# EAGLE design Tiles_Proto2_RevD (EAGLE 8.4.1)
CNAME: Tiles; CREVISION: D; DESIGNER: Simone Mora
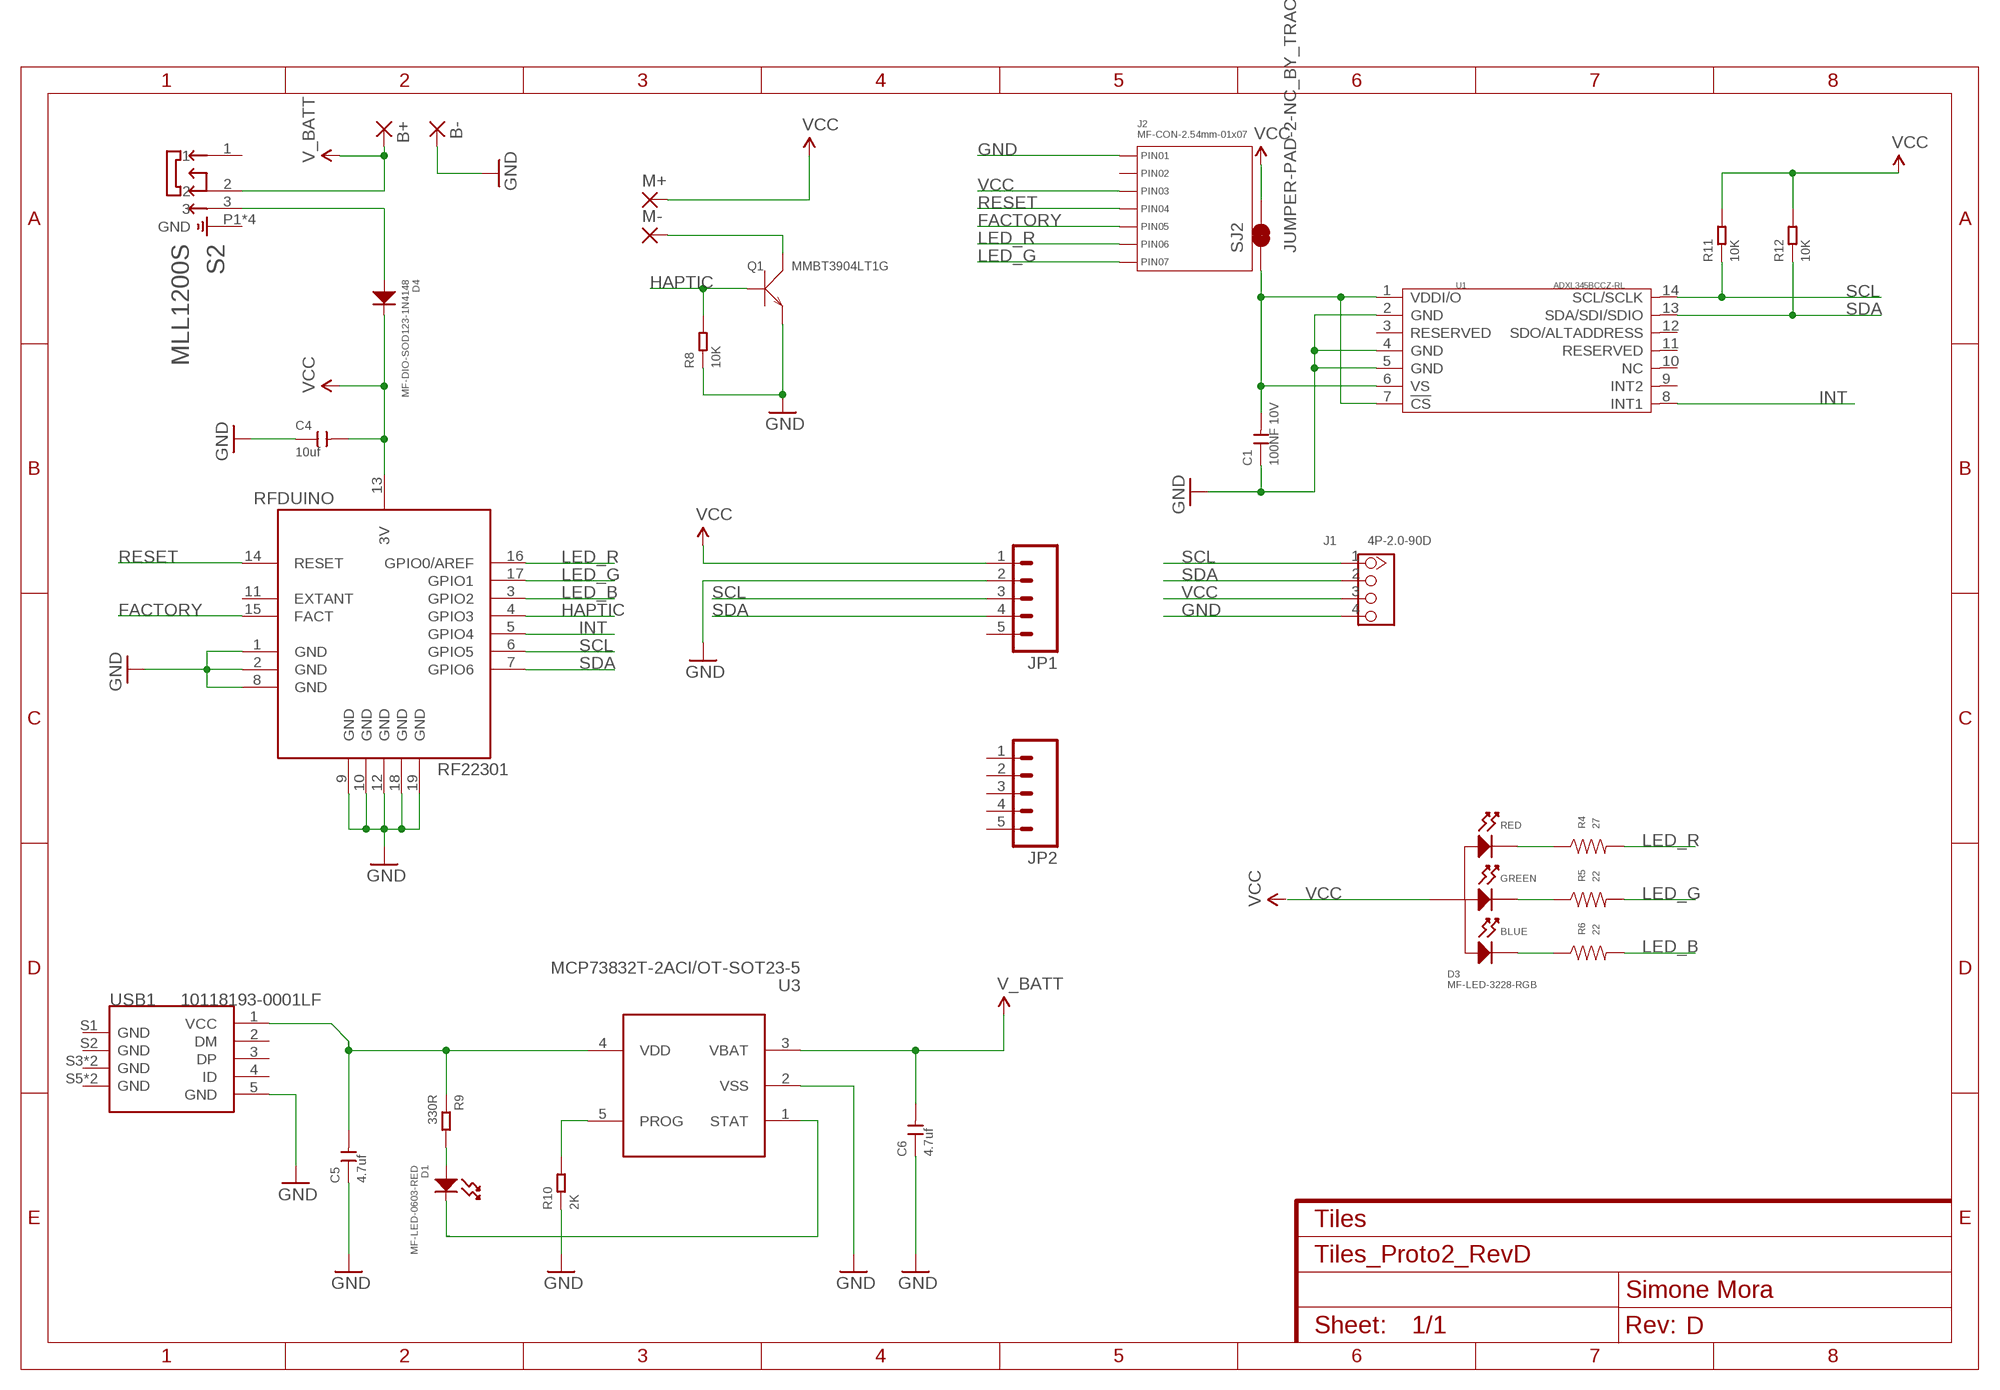
[diagram p0: schematic, sheet 1]

## Parts
B+  SMD2  [SMD1,27-2,54]
B-  SMD2  [SMD1,27-2,54]
C1  100NF 10V  CERAMIC 100NF-10V-10%-X5R(0402)  [C0402]
C4  10uf  CERAMIC-10UF-6.3V-20%-X5R(0402)  [C0402]
C5  4.7uf  CERAMIC-4.7UF-6.3V-20%-X5R(0402)  [C0402]
C6  4.7uf  CERAMIC-4.7UF-6.3V-20%-X5R(0402)  [C0402]
D1  MF-LED-0603-RED  LED_SINGLE-0603-RED  [LED0603]
D3  MF-LED-3228-RGB  LED_RGB_CA_PLCC4  [PLCC4]
D4  MF-DIO-SOD123-1N4148  DIODES_1N4148_SOD-123  [SOD-123]
J1  4P-2.0-90D  GROVE-CONNECTOR-DIP-90D(4P-2.0)  [HW4-2.0-90D]
J2  MF-CON-2.54mm-01x07  CON_01X07_PTH_2.54MM  [PTH_2.54MM_01X07]
JP1  M05PTH  [1X05]
JP2  M05PTH  [1X05]
M+  SMD2  [SMD1,27-2,54]
M-  SMD2  [SMD1,27-2,54]
Q1  MMBT3904LT1G  SMD-TRANSISTORS-NPN-40V-200MA-MMBT3904LT1G(SOT-23)  [SOT-23]
R4  27  RESISTOR_0603  [R0603]
R5  22  RESISTOR_0603  [R0603]
R6  22  RESISTOR_0603  [R0603]
R8  10K  SMD-RES-10K-1%-1/10W(0603)  [R0603]
R9  330R  SMD-RES-330R-1%-1/10W(0603)  [R0603]
R10  2K  SMD-RES-2K-5%-1/10W(0603)  [R0603]
R11  10K  SMD-RES-10K-1%-1/10W(0603)  [R0603]
R12  10K  SMD-RES-10K-1%-1/10W(0603)  [R0603]
RFDUINO  RF22301  [RFD22301]
S2  MLL1200S  [SW_MLL1200S]
SJ2  JUMPER-PAD-2-NC_BY_TRACE  [PAD-JUMPER-2-NC_BY_TRACE_YES_SILK]
U1  ADXL345BCCZ-RL  MOTION/POSITION-ADXL345BCCZ-RL(14P-5.0X3.0MM)  [LGA14-0.8-5.0X3.0MM]
U3  MCP73832T-2ACI/OT-SOT23-5  PMIC-MCP73832T-2ACI/OT(SOT23-5)  [SOT-23-5]
USB1  10118193-0001LF  MICRO-USB-SMD-B-(10118193-0001LF)  [MICRO-USB5+6P-SMD-0.65-B]

## Nets
FACTORY: J2.P$5(PIN5) RFDUINO.15(FACT)
GND: B-.1(P) C1.1 C4.1 C5.1 C6.1 J1.4 J2.P$1(PIN1) JP1.2 Q1.2(E) R8.1 R10.1 RFDUINO.1(GND) RFDUINO.2(GND) RFDUINO.8(GND) RFDUINO.9(GND) RFDUINO.10(GND) RFDUINO.12(GND) RFDUINO.18(GND) RFDUINO.19(GND) U1.2(GND) U1.4(GND) U1.5(GND) U3.2(VSS) USB1.5(GND)
HAPTIC: Q1.1(B) R8.2 RFDUINO.4(GPIO3)
INT: RFDUINO.5(GPIO4) U1.8(INT1)
LED_B: R6.P$2 RFDUINO.3(GPIO2)
LED_G: J2.P$7(PIN7) R5.P$2 RFDUINO.17(GPIO1)
LED_R: J2.P$6(PIN6) R4.P$2 RFDUINO.16(GPIO0/AREF)
N$5: D3.P$2(CATHODE_RED) R4.P$1
N$6: D3.P$3(CATHODE_GREEN) R5.P$1
N$7: M-.1(P) Q1.3(C)
N$8: C5.2 R9.1 U3.4(VDD) USB1.1(VCC)
N$9: D4.ANODE S2.3
N$10: D1.ANODE R9.2
N$11: D1.CATHODE U3.1(STAT)
N$12: R10.2 U3.5(PROG)
N$13: D3.P$4(CATHODE_BLUE) R6.P$1
RESET: J2.P$4(PIN4) RFDUINO.14(RESET)
SCL: J1.1 JP1.3 R11.1 RFDUINO.6(GPIO5) U1.14(SCL/SCLK)
SDA: J1.2 JP1.4 R12.1 RFDUINO.7(GPIO6) U1.13(SDA/SDI/SDIO)
V_BATT: B+.1(P) C6.2 S2.2 U3.3(VBAT)
VCC: C4.2 D3.P$1(ANODE) D4.CATHODE J1.3 J2.P$3(PIN3) JP1.1 M+.1(P) R11.2 R12.2 RFDUINO.13(3V) SJ2.2
VDDI/O: C1.2 SJ2.1 U1.1(VDDI/O) U1.6(VS) U1.7(!CS)
Unconnected: J2.P$2(PIN2) JP1.5 JP2.1 JP2.2 JP2.3 JP2.4 JP2.5 RFDUINO.11(EXTANT) S2.1 U1.3(RESERVED) U1.9(INT2) U1.10(NC) U1.11(RESERVED) U1.12(SDO/ALTADDRESS) USB1.2(DM) USB1.3(DP) USB1.4(ID) USB1.S1(GND) USB1.S2(GND) USB1.S3(GND) USB1.S4(GND) USB1.S5(GND) USB1.S6(GND)

## Power pins joined to a net without a drawn wire
GND: S2.P1(GND) S2.P2(GND) S2.P3(GND) S2.P4(GND)

## Library data of the parts
B+ B- M+ M- = wirepad:SMD2: SMD PAD
C1 = Seeed-OPL-Capacitor:CERAMIC 100NF-10V-10%-X5R(0402): 302010037; MPN: CC0402KRX5R6BB104
C4 = Seeed-OPL-Capacitor:CERAMIC-10UF-6.3V-20%-X5R(0402): 302010053; MPN: CC0402MRX5R5BB106
C5 C6 = Seeed-OPL-Capacitor:CERAMIC-4.7UF-6.3V-20%-X5R(0402): 302010019; MPN: CC0402MRX5R5BB475
D1 = MF_LEDs:LED_SINGLE: Library: MF_LEDs Description: Device for Single LED Packages. Manufacture part number (MFG#) can be added via Attributes.; HOUSEPART: YES; MPN: MF-LED-0603-RED; POPULATE: 1; URL: https://factory.macrofab.com/part/MF-LED-0603-RED
D3 = MF_LEDs:LED_RGB_CA: Library: MF_LEDs Description: Device for RGB LED Packages with Common Anodes. Manufacture part number (MFG#) can be added via Attributes.; HOUSEPART: YES; MPN: MF-LED-3228-RGB; POPULATE: 1; URL: https://factory.macrofab.com/part/MF-LED-3228-RGB
D4 = MF_Discrete_Semiconductor:DIODES: Library: MF_Discrete_Semiconductor Description: Device for Single Packaged Diodes.; HOUSEPART: YES; MPN: MF-DIO-SOD123-1N4148; POPULATE: 1; URL: https://factory.macrofab.com/part/MF-DIO-SOD123-1N4148
J1 = Seeed-OPL-Connector:GROVE-CONNECTOR-DIP-90D(4P-2.0): 320110034
J2 = MF_Connectors:CON_01X07: Library: MF_Connectors Description: Header Connector with 7 Positions and 01 Rows. Use the LABEL Attribute to label the pin on the schematic and PCB. You can remove the attributes on the PCB by using the SMASH function on the part and then deleting the text.; HOUSEPART: YES; MPN: MF-CON-2.54mm-01x07; POPULATE: 1; URL: https://factory.macrofab.com/part/MF-CON-2.54mm-01x07
JP1 JP2 = SparkFun-Connectors:M05: Header 5 Standard 5-pin 0.1" header. Use with straight break away headers (SKU : PRT-00116), right angle break away headers (PRT-00553), swiss pins (PRT-00743), machine pins (PRT-00117), and female headers (PRT-00115). Molex polarized connector foot print use with SKU : PRT-08230 with associated crimp pins and housings.
Q1 = Seeed-OPL-Transistor:SMD-TRANSISTORS-NPN-40V-200MA-MMBT3904LT1G(SOT-23): 305010013; MPN: MMBT3904LT1G
R4 = MF_Passives:RESISTOR: Library: MF_Passives Description: Device for Resistors. Manufacture part number (MPN), Voltage, Tolerance, and Wattage Rating can be added via Attributes. Check https://factory.macrofab.com/parts for the house parts list.; HOUSEPART: MF-RES-0603-27; POPULATE: 1
R5 R6 = MF_Passives:RESISTOR: Library: MF_Passives Description: Device for Resistors. Manufacture part number (MPN), Voltage, Tolerance, and Wattage Rating can be added via Attributes. Check https://factory.macrofab.com/parts for the house parts list.; HOUSEPART: MF-RES-0603-22; POPULATE: 1
R8 R11 R12 = Seeed-OPL-Resistor:SMD-RES-10K-1%-1/10W(0603): 301010299; MPN: RC0603FR-0710KL
R9 = Seeed-OPL-Resistor:SMD-RES-330R-1%-1/10W(0603): 301010300; MPN: RC0603FR-07330RL
R10 = Seeed-OPL-Resistor:SMD-RES-2K-5%-1/10W(0603): 301010113; MPN: RC0603JR-072KL
RFDUINO = GeekAmmo:RF22301: RFD22301 RFDuino Bluetooth 4.0 Low Energy BLE RF Module With Built-In ARM Cortex M0 Microconroller Hi performance, professional grade Bluetooth 4.0 Low Energy radio transceiver with built-in ARM Cortex M0 microcontroller that can be programmed using the simple-to-use Arduino IDE using RFduino extensions. Built-in user application microcontroller with ADC, I2C, SPI, UART and GPIO. http://www.rfduino.com/
S2 = MLL1200S:MLL1200S: Switch Slide SPDT Side Slide 0.3A 4VDC Gull Wing SMD Box; AVAILABILITY: Good; DESCRIPTION: Switch Slide SPDT Side Slide 0.3A 4VDC Gull Wing SMD Box; MF: TE Connectivity; MP: MLL1200S; PACKAGE: None; PRICE: 1.59 USD
SJ2 = SparkFun-Passives:JUMPER-PAD-2-NC_BY_TRACE
U1 = Seeed-OPL-sensor:MOTION/POSITION-ADXL345BCCZ-RL(14P-5.0X3.0MM): 314080008; MPN: ADXL345BCCZ-RL
U3 = Seeed-OPL-ic:PMIC-MCP73832T-2ACI/OT(SOT23-5): 310030238; MPN: MCP73832T-2ACI/OT
USB1 = Seeed-OPL-Connector:MICRO-USB-SMD-B-(10118193-0001LF): 320010003; MPN: 10118193-0001LF

## Board
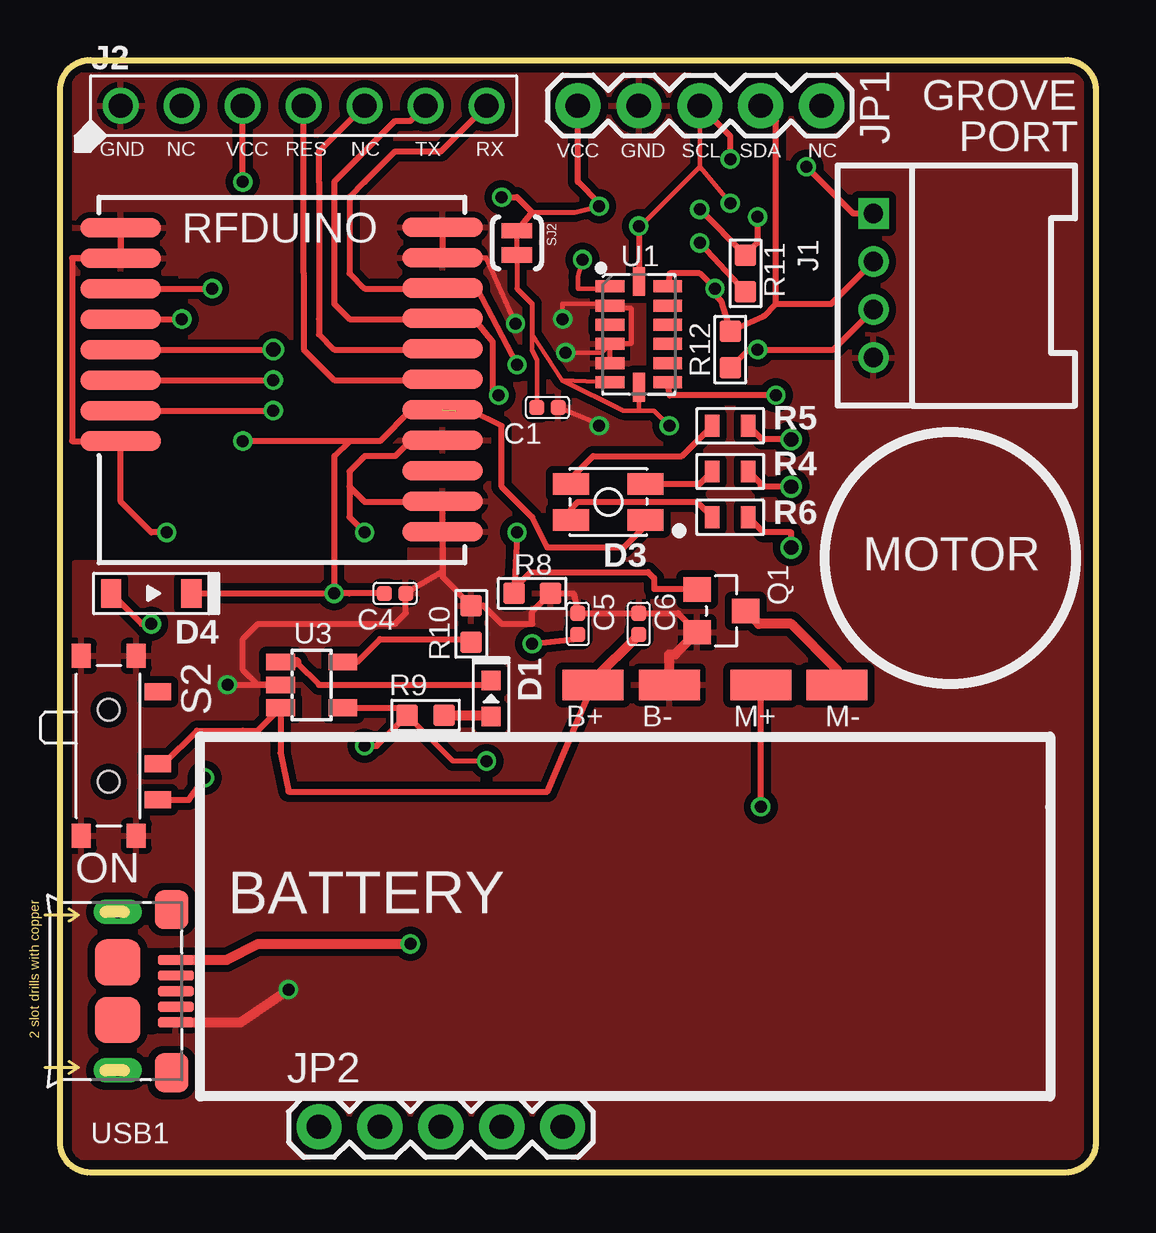
[diagram p1: board, top side]
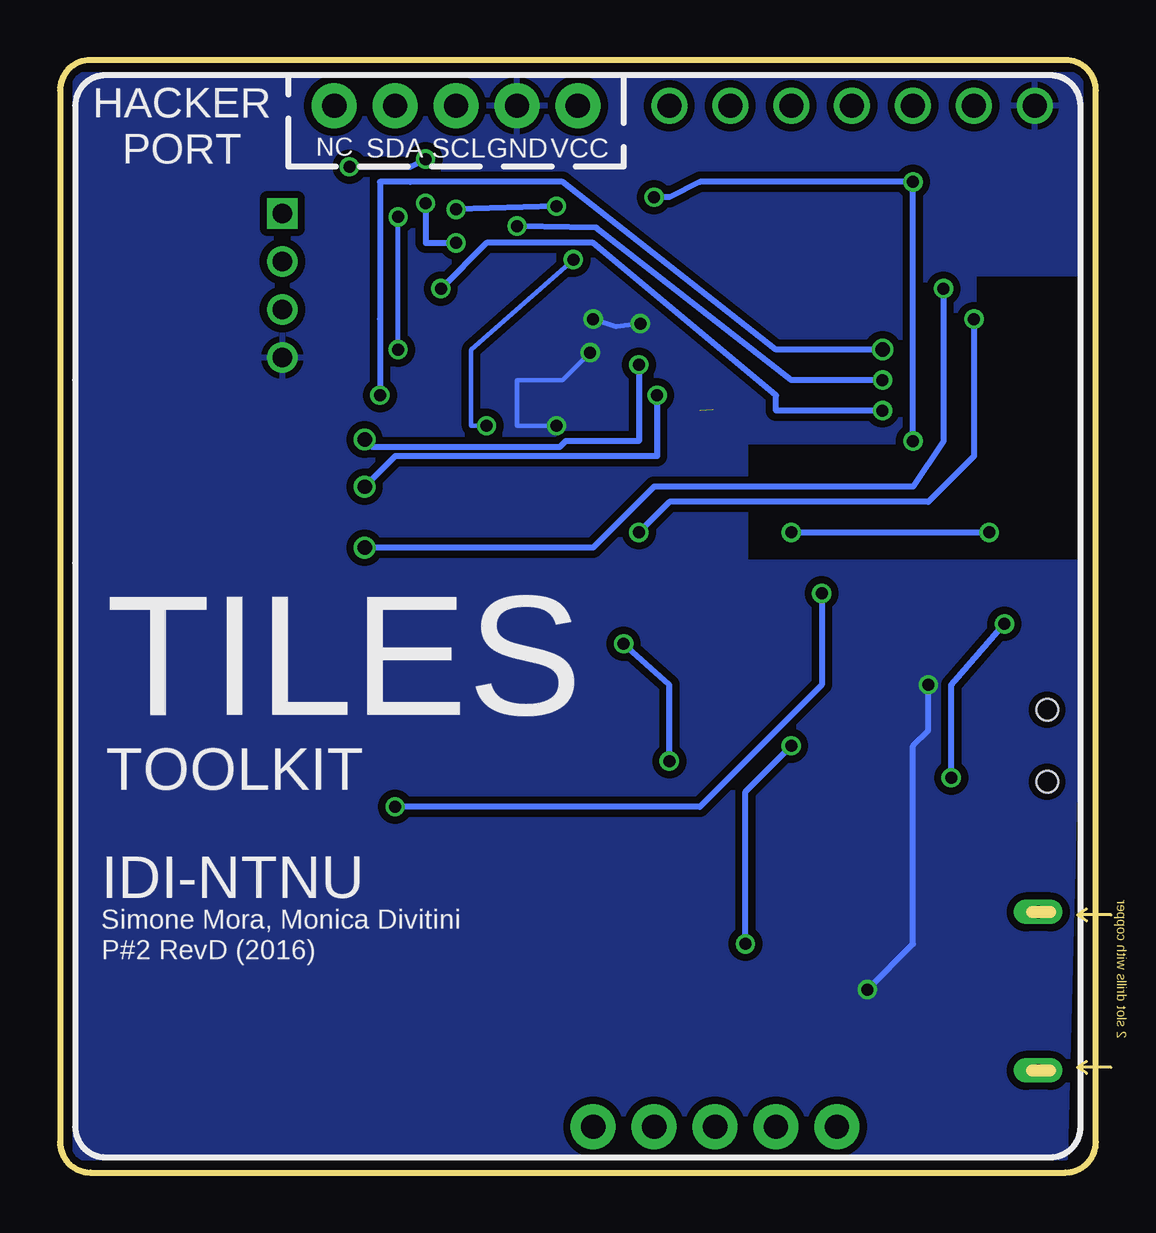
[diagram p2: board, bottom side, seen from below]

Size 43.18 x 46.36 mm. Coordinates in mm from the lower left corner, seen from the top.
Outline: 41.91,0 1.27,0 arc-90 0,1.27 0,45.08 arc-90 1.27,46.36 41.91,46.36 arc-90 43.18,45.08 43.18,1.27 arc-90 41.91,0
Copper layers (1*16): Top 0.035mm / dielectric 1.5mm / Bottom 0.035mm
Design rules "MF_Standard_2_Layer": minimum track width 5mil, minimum drill 12mil, track to track 5mil, track to pad 5mil, pad to pad 5mil, via to via 5mil, smd to smd 0mil, copper to edge 10mil, drill to drill 10mil, minimum pad ring 6mil, minimum via ring 6mil, stop-mask expansion 2mil, vias tented up to drill 25mil, thermal gap 10mil

### Footprints (pad centres in the part's own frame; a part is rotated, then mirrored left to right if it is on the bottom)
SMD1,27-2,54 = smd 1.27 x 2.54: 1 0,0
C0402 = smd 0.635 x 0.635: 1 0,0.445; 2 0,-0.445
LED0603 = smd 0.8 x 0.8: ANODE 0.75,0; CATHODE -0.75,0
PLCC4 = smd 1.5 x 0.9: P$1 -1.55,0.75; P$2 -1.55,-0.75; P$3 1.55,-0.75; P$4 1.55,0.75
SOD-123 = smd 0.85 x 1.2: ANODE 1.675,0; CATHODE -1.675,0
HW4-2.0-90D = drill 0.8 pad 1.27 square: 1 -3,0 | drill 0.8 pad 1.27: 2 -1,0; 3 1,0; 4 3,0
PTH_2.54MM_01X07 = drill 1: P$1 -7.62,0; P$2 -5.08,0; P$3 -2.54,0; P$4 0,0; P$5 2.54,0; P$6 5.08,0; P$7 7.62,0
1X05 = drill 1.016 pad 1.88: 1 0,0; 2 2.54,0; 3 5.08,0; 4 7.62,0; 5 10.16,0
SOT-23 = smd 1.016 x 1.143: 1 -0.889,-1.016; 2 0.889,-1.016; 3 0,1.016
R0603 = smd 0.6 x 0.9: P$1 -0.75,0; P$2 0.75,0
R0603' = smd 0.889 x 0.889: 1 0,0.762; 2 0,-0.762
RFD22301 = smd 3.353 x 0.813: 1 0,0; 2 0,-1.27; 3 0,-2.54; 4 0,-3.81; 5 0,-5.08; 6 0,-6.35; 7 0,-7.62; 8 0,-8.89; 9 13.411,-12.675; 10 13.411,-11.405; 11 13.411,-10.135; 12 13.411,-8.865; 13 13.411,-7.595; 14 13.411,-6.325; 15 13.411,-5.055; 16 13.411,-3.785; 17 13.411,-2.515; 18 13.411,-1.245; 19 13.411,0.025
SW_MLL1200S = smd 0.7 x 1.1: 1 -2.25,2.05; 2 0.75,2.05; 3 2.25,2.05 | smd 1 x 0.8: P1 -3.75,1.15; P2 3.75,1.15; P3 3.75,-1.15; P4 -3.75,-1.15 | hole 0.9: -1.5,0; 1.5,0
PAD-JUMPER-2-NC_BY_TRACE_YES_SILK = smd 0.635 x 1.27: 1 -0.508,0; 2 0.508,0
LGA14-0.8-5.0X3.0MM = smd 1.2 x 0.5: 1 -1.2,2; 2 -1.2,1.2; 3 -1.2,0.4; 4 -1.2,-0.4; 5 -1.2,-1.2; 6 -1.2,-2; 8 1.2,-2; 9 1.2,-1.2; 10 1.2,-0.4; 11 1.2,0.4; 12 1.2,1.2; 13 1.2,2 | smd 0.5 x 1.2: 7 0,-2.2; 14 0,2.2
SOT-23-5 = smd 0.69 x 1.2: 1 -0.95,-1.3; 2 0,-1.3; 3 0.95,-1.3; 4 0.95,1.3; 5 -0.95,1.3
MICRO-USB5+6P-SMD-0.65-B = smd 0.4 x 1.5: 1 -1.3,-0.25; 2 -0.65,-0.25; 3 0,-0.25; 4 0.65,-0.25; 5 1.3,-0.25 | smd 1.6 x 1.4: S1 -3.4,-0.427; S6 3.4,-0.427 | drill 0.508 pad 1.016 long: S2 -3.3,-2.675; S5 3.3,-2.675 | smd 1.9 x 1.9: S3 -1.2,-2.675; S4 1.2,-2.675

### Placement (x,y rotation side)
B+  22.22,20.32 270 top
B-  25.4,20.32 270 top
C1  20.32,31.88 270 top
C4  13.97,24.13 270 top
C5  21.59,22.86 0 top
C6  24.13,22.86 0 top
D1  17.97,19.75 270 top
D3  22.86,27.94 180 top
D4  3.81,24.13 180 top
J1  33.91,36.96 270 top
J2  10.16,44.45 0 top
JP1  21.59,44.45 0 top
JP2  10.79,1.91 0 top
M+  29.21,20.32 270 top
M-  32.38,20.32 270 top
Q1  27.57,23.4 270 top
R4  [R0603]  27.94,29.21 0 top
R5  [R0603]  27.94,31.11 0 top
R6  [R0603]  27.94,27.3 0 top
R8  10K  [R0603']  19.68,24.13 270 top
R9  330R  [R0603']  15.24,19.05 90 top
R10  2K  [R0603']  17.14,22.86 0 top
R11  10K  [R0603']  28.57,37.47 180 top
R12  10K  [R0603']  27.94,34.29 0 top
RFDUINO  2.54,39.37 0 top
S2  2.03,17.78 270 top
SJ2  19.05,38.73 90 top
U1  24.13,34.92 0 top
U3  10.5,20.31 270 top
USB1  5.08,7.56 270 top

### Tracks (layer width: path | path; a pad name or v marks a point on that pad's centre or on a via)
FACTORY
  Top 0.254: RFDUINO.15 15.93,34.29 11.43,34.29 10.79,34.92 10.79,35.56 10.79,41.27 10.79,42.55 J2.P$5
GND  (via drill 0.5)
  Top 0.178: U1.5 U1.4 22.57,34.16 v21.08,34.16 | RFDUINO.18 17.75,38.12 v18.99,35.37 | C1.1 22.35,31.24 v22.48,31.11 | v20.95,35.56 20.95,36.19 22.86,36.19 U1.2
  Top 0.203: 22.92,34.53 U1.4 22.95,34.54 23.81,34.54 23.81,36 23.05,36 U1.2
  Top 0.254: RFDUINO.1 RFDUINO.2 0.51,38.1 0.51,30.48 RFDUINO.8 2.54,27.94 3.81,26.67 v4.44,26.67 | RFDUINO.19 RFDUINO.18 | RFDUINO.12 14.63,30.5 13.97,29.84 12.7,29.84 12.07,29.21 | 12.07,29.21 12.07,28.58 12.7,27.94 15.93,27.94 | 15.93,27.94 RFDUINO.10 | 15.93,27.94 15.93,26.72 RFDUINO.9 15.95,25.03 | 15.95,25.03 C4.1 14.42,23.3 13.97,22.86 8.26,22.86 7.62,22.22 7.62,20.95 8.26,20.31 U3.2 v6.99,20.32 | 12.07,29.21 12.07,27.3 v12.7,26.67 | 15.95,25.03 15.95,24.82 R10.1 17.65,23.62 18.41,22.86 19.68,22.86 19.68,23.37 R8.1 21.4,24.13 C5.1 C6.1 25.77,23.3 Q1.2
  Top 0.406: USB1.5 7.53,6.26 v9.53,7.62 | B-.1 25.4,21.59 25.64,21.59 Q1.2
  Bottom 0.178: v22.48,31.11 22.86,31.11 24.13,31.11 24.13,33.02 22.22,33.02 v21.08,34.16
  Bottom 0.203: v18.99,35.37 20,35.24 v20.95,35.56
  Bottom 0.254: v12.7,26.67 v4.44,26.67 | v9.53,7.62 7.62,9.52 7.62,17.78 6.99,18.41 v6.99,20.32
  pour Top (isolate 0.305): 0.64,45.72 42.55,45.72 42.55,0.63 0.64,0.63 0.64,25.4 14.61,25.4 14.61,30.48 5.08,30.48 5.08,37.47 0.64,37.47
  pour Bottom (isolate 0.305): 0.64,45.72 42.55,45.72 42.55,0.63 1.27,0.63 0.64,25.4 14.61,25.4 14.61,30.48 5.08,30.48 5.08,37.47 0.64,37.47
HAPTIC  (via drill 0.5)
  Top 0.254: RFDUINO.4 v5.08,35.56 | v19.05,26.67 19.05,26.54 R8.2 18.92,24.32 19.62,25.02 24.51,25.02 24.77,24.77 24.77,24.32 26.53,24.32 Q1.1
  Bottom 0.254: v5.08,35.56 5.08,29.84 6.99,27.94 17.78,27.94 v19.05,26.67
INT  (via drill 0.5, 0.6)
  Top 0.254: RFDUINO.5 v8.89,34.29 | v29.84,32.38 25.42,32.38 U1.8
  Bottom 0.254: v8.89,34.29 13.34,34.29 22.22,41.27 28.57,41.27 29.84,41.27 29.84,35.56 v29.84,32.38
LED_B  (via drill 0.5, 0.6)
  Top 0.254: RFDUINO.3 v6.35,36.83 | v30.48,26.03 30.48,26.67 29.32,26.67 R6.P$2
  Bottom 0.254: v6.35,36.83 6.35,30.48 7.62,28.58 18.03,28.58 18.41,28.58 20.95,26.03 27.94,26.03 29.21,26.03 v30.48,26.03
LED_G  (via drill 0.5, 0.6)
  Top 0.254: v19.05,33.66 17.37,36.86 RFDUINO.17 15.93,36.83 12.7,36.83 12.07,37.47 12.07,40.64 12.7,41.27 13.97,42.55 15.88,42.55 J2.P$7 | v30.48,30.54 29.26,30.54 R5.P$2
  Bottom 0.254: v19.05,33.66 19.05,30.48 21.59,30.48 22.1,30.48 22.35,30.23 30.16,30.23 v30.48,30.54
LED_R  (via drill 0.5, 0.6)
  Top 0.254: J2.P$6 14.61,43.81 13.97,43.81 11.43,41.27 11.43,36.19 12.07,35.56 15.93,35.56 RFDUINO.16 17.12,35.58 17.25,35.58 18.03,34.61 18.03,32.45 v18.29,32.38 | v30.48,28.58 29.21,28.58 29.21,28.69 R4.P$2
  Bottom 0.254: v18.29,32.38 18.29,29.84 20.32,29.84 20.95,29.84 27.94,29.84 29.21,29.84 v30.48,28.58
N$5
  Top 0.254: D3.P$2 26.67,28.69 R4.P$1
N$6
  Top 0.254: D3.P$3 21.31,28.93 22.22,29.84 25.92,29.84 R5.P$1
N$7
  Top 0.406: M-.1 32.38,20.95 30.48,22.86 29.13,22.86 Q1.3
N$8  (via drill 0.5)
  Top 0.203: v17.78,17.14 16.38,17.14 R9.1
  Top 0.254: U3.4 14.16,19.36 R9.1 13.21,17.78 v12.7,17.78 | v19.68,22.03 21.4,22.22 C5.2
  Top 0.406: USB1.1 6.95,8.86 8.26,9.52 9.53,9.52 v14.61,9.52
  Bottom 0.254: v14.61,9.52 14.61,15.88 v12.7,17.78 | v17.78,17.14 17.78,20.32 v19.68,22.03
N$9  (via drill 0.5)
  Top 0.254: S2.3 4.15,15.53 5.37,15.53 v6.03,16.45 | 1.91,23.72 D4.ANODE 3.4,22.86 v3.81,22.86
  Bottom 0.254: v6.03,16.45 6.03,20.32 v3.81,22.86
N$10
  Top 0.406: R9.2 17.92,19.05 D1.ANODE
N$11
  Top 0.254: 9.85,21.27 10.79,20.32 17.79,20.32
  Top 0.406: U3.1 9.85,21.27 | 17.79,20.32 D1.CATHODE
N$12
  Top 0.254: U3.5 12.38,21.27 13.34,22.22 17.02,22.22 R10.2
N$13
  Top 0.254: D3.P$4 21.31,27.66 21.59,27.94 26.04,27.94 26.55,27.94 R6.P$1
RESET
  Top 0.254: RFDUINO.14 15.93,33.02 11.43,33.02 10.16,34.29 10.16,37.47 J2.P$4
SCL  (via drill 0.5)
  Top 0.178: v27.94,40.39 26.67,41.91 | 26.67,41.91 JP1.3 | v24.13,39.43 24.19,39.43 26.67,41.91
  Top 0.254: RFDUINO.6 v8.89,33.02 | v24.13,39.43 U1.14 | v26.67,38.73 R11.1 | J1.1 33.07,39.96 v31.12,41.91 | v27.94,42.23 27.94,43.18 JP1.3
  Bottom 0.254: v8.89,33.02 12.7,33.02 20.83,39.37 v24.13,39.43 | v27.94,40.39 27.94,38.73 v26.67,38.73 | v31.12,41.91 28.57,41.91 v27.94,42.23
SDA  (via drill 0.5)
  Top 0.254: RFDUINO.7 v8.89,31.75 | U1.13 25.42,37.47 26.67,37.47 v27.3,36.83 27.3,36.58 27.56,36.32 R12.1 29.34,35.69 29.84,36.19 | 29.84,36.19 29.84,43.18 29.84,43.81 JP1.4 | 29.84,36.19 32.15,36.19 J1.2
  Bottom 0.254: v8.89,31.75 13.34,31.75 13.34,32.38 20.95,38.73 25.4,38.73 v27.3,36.83
V_BATT
  Top 0.254: U3.3 | U3.3 9.2,17.47 9.53,15.88 20.32,15.88 B+.1 | U3.3 8.25,18.41 7.62,18.41 5.71,18.41 4.33,17.03 S2.2
  Top 0.406: B+.1 22.22,20.51 C6.2
VCC  (via drill 0.5)  (1 unrouted)
  Top 0.203: R12.2 28.7,34.29 v29.08,34.29 | 19.68,40 21.46,40 v22.48,40.26
  Top 0.254: v18.41,40.64 19.05,40.64 19.68,40 SJ2.2 | RFDUINO.13 14.63,31.77 13.34,30.48 | 13.34,30.48 v7.62,30.48 | 13.34,30.48 12.07,30.48 11.43,29.84 11.43,24.38 v11.43,24.13 | 12.07,24.13 C4.2 12.07,24.13 | 12.07,24.13 v11.43,24.13 | 12.07,24.13 v11.43,24.13 | v29.21,15.24 M+.1 | v7.62,41.27 J2.P$3 | D3.P$1 24.41,26.95 23.49,26.03 20.32,26.03 19.68,27.3 18.41,28.58 18.41,31.11 17.14,31.75 16.51,31.75 | D4.CATHODE 9.97,24.13 v11.43,24.13 | v26.67,40.13 R11.2 29.08,38.73 v29.08,39.81 | v29.08,34.29 32.24,34.29 J1.3 | v22.48,40.26 22.48,40.39 21.59,41.27 JP1.1
  Bottom 0.203: v29.08,34.29 v29.08,39.81
  Bottom 0.254: v18.41,40.64 17.78,40.64 16.51,41.27 v7.62,41.27 v7.62,30.48 | v22.48,40.26 v26.67,40.13 | v11.43,24.13 11.43,20.32 16.51,15.24 v29.21,15.24
VDDI/O  (via drill 0.5)
  Top 0.178: 20.93,33.02 19.68,34.92 19.68,34.29 19.88,33.85 C1.2 | 20.93,33.02 U1.6 | 20.93,33.02 23.49,31.75 24.13,31.75 | 24.13,31.75 24.77,31.75 v25.4,31.11 | v21.78,38.04 21.59,37.34 21.59,36.83 22.83,36.83 U1.1 | U1.7 24.13,31.75
  Top 0.203: SJ2.1 19.05,36.83 19.68,36.19 19.68,34.92
  Bottom 0.178: v25.4,31.11 26.04,31.11 26.04,34.29 v21.78,38.04

### Text on the board
tPlace: GROVE | GND | NC | VCC | RES | NC | TX | RX | VCC | GND | SCL | SDA | NC | PORT | MOTOR | ON | BATTERY
bPlace: HACKER / PORT | VCC | GND | SCL | SDA | NC | TILES | TOOLKIT | IDI-NTNU | Simone Mora, Monica Divitini | P#2 RevD (2016)